# EAGLE design Infrared Temperature Sensor V1.0 (EAGLE 5.11)
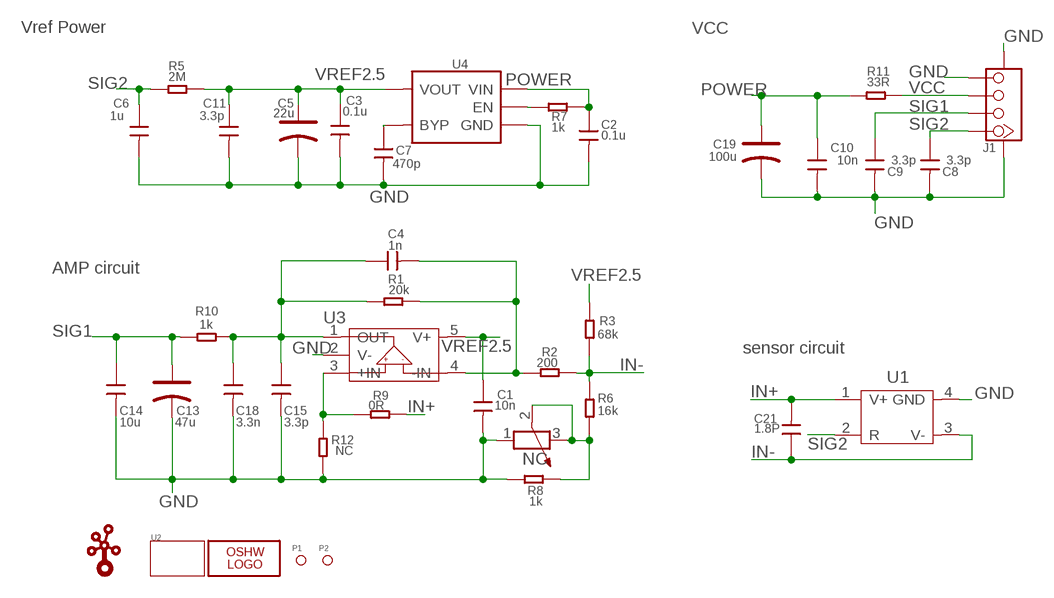
[diagram p0: schematic, sheet 1]

## Parts
C1  10n  C-0603  [0603]
C2  0.1u  C-0402  [0402]
C3  0.1u  C-0402  [0402]
C4  1n  C-0603  [0603]
C5  22u  CAP-AVX-A  [AVX-A]
C6  1u  C-0603  [0603]
C7  470p  C-0402  [0402]
C8  3.3p  C-0402  [0402]
C9  3.3p  C-0402  [0402]
C10  10n  C-0402  [0402]
C11  3.3p  C-0402  [0402]
C13  47u  CAP-AVX-A  [AVX-A]
C14  10u  C-0603  [0603]
C15  3.3p  C-0603  [0603]
C18  3.3n  C-0603  [0603]
C19  100u  CAP-AVX-B  [AVX-B]
C21  1.8P  C-0603  [0603]
J1  TWIG-4P-2.0-SMD-FEMALE-REINFORCE'90D'  [4P-SMD-2.0-90D]
LOGO1  LOGO-OSHW-6MILX0200-NT  [OSHW_6X200_NOTEXT]
P1  PAD-MARK  [ROUND-MARK-0.635]
P2  PAD-MARK  [ROUND-MARK-0.635]
R1  20k  R-0603  [0603]
R2  200  R-0603  [0603]
R3  68k  R-0603  [0603]
R4  NC  R-POTENTIOMETER-SMD  [3P-SMD-SQUA-3.6X3.3]
R5  2M  R-0402  [0402]
R6  16k  R-0603  [0603]
R7  1k  R-0402  [0402]
R8  1k  R-0603  [0603]
R9  0R  R-0603  [0603]
R10  1k  R-0603  [0603]
R11  33R  R-0402  [0402]
R12  NC  R-0603  [0603]
U1  SENSOR-OTP-538U  [4P-5.4MM]
U2  TWIG-2U  [2U-DIM-W/-DRILL]
U3  OPA333  [SOT23-5]
U4  MIC5205  [SOT23-5]
U$1  LOGO-TWIGTWIGLOGO_SMALL  [TWIGLOGO_SMALL]

## Nets
GND: C1.2 C2.2 C3.2 C5.- C6.2 C7.2 C8.2 C9.2 C10.2 C11.2 C13.- C14.2 C15.2 C18.2 C19.- J1.4 J1.SS1 J1.SS2 R4.1 R8.1 R12.1 U1.4(GND) U3.2(V-) U4.2(GND)
IN+: C21.2 R9.1 U1.1(V+)
IN-: C21.1 R2.1 R3.2 R6.1 U1.3(V-)
N$1: C4.2 R1.1 R2.2 U3.4(-IN)
N$2: R4.2 R4.3 R6.2 R8.2
N$3: R7.1 U4.3(EN)
N$4: R9.2 R12.2 U3.3(+IN)
N$5: C7.1 U4.4(BYP)
N$10: C4.1 C15.1 C18.1 R1.2 R10.1 U3.1(OUT)
POWER: C2.1 C10.1 C19.+ R7.2 R11.1 U4.1(VIN)
SIG1: C9.1 C13.+ C14.1 J1.2 R10.2
SIG2: C6.1 C8.1 J1.1 R5.1 U1.2(R)
VCC: J1.3 R11.2
VREF2.5: C1.1 C3.1 C5.+ C11.1 R3.1 R5.2 U3.5(V+) U4.5(VOUT)

## Notes on the sheet
- Vref Power | VCC
- AMP circuit
- sensor circuit

## Library data of the parts
C1-C4 C6-C11 C14 C15 C18 C21 = Discrete:C*: Ceramic Capacitors
C5 C13 C19 = Discrete:CAP*: Electrolytic Capacitors,Tantalum Capacitors and Super Capacitors
J1 = Connector:TWIG-4P-2.0-SMD-FEMALE-REINFORCE
LOGO1 = Logo:LOGO-OSHW-6MIL
P1 P2 = Discrete:PAD-MARK
R1-R3 R5-R12 = Discrete:R*
R4 = Discrete:R-POTENTIOMETER*: Potentiometer
U1 = Discrete:SENSOR-OTP-538U
U2 = Module:TWIG
U3 = IC:OPA333
U4 = IC:MIC5205: The MIC5205 is an efficient linear voltage regulator with ultra-low-noise output, very low dropout voltage (typically 17mV at light loads and 165mV at 150mA), and very low ground current (600µA at 100mA output). The MIC5205 offers better than 1% initial accuracy. datasheet here: http://www.micrel.com/product-info/prod/5205.shtml
U$1 = Logo:LOGO-TWIG

## Board
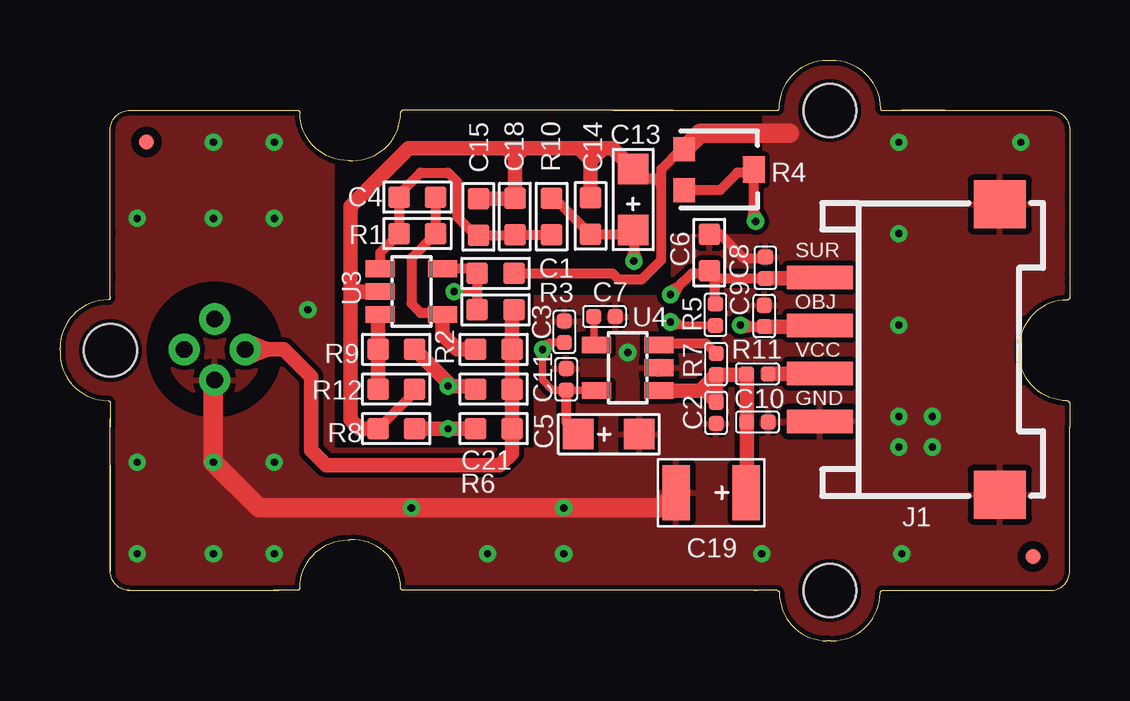
[diagram p1: board, top side]
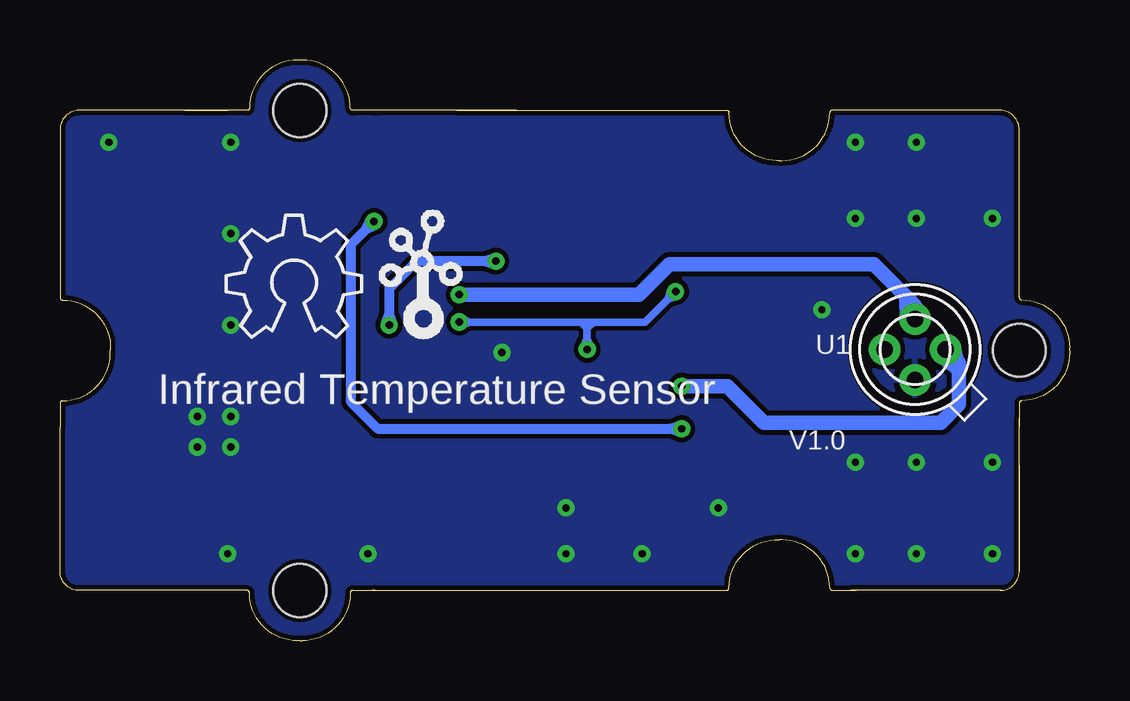
[diagram p2: board, bottom side, seen from below]

Size 42.09 x 24.2 mm. Coordinates in mm from the lower left corner, seen from the top.
Copper layers (1*16): Top 0.035mm / dielectric 1.5mm / Bottom 0.035mm
Design rules "default *": minimum track width 6mil, minimum drill 12mil, track to track 8mil, track to pad 8mil, pad to pad 8mil, via to via 8mil, smd to smd 8mil, copper to edge 8mil, drill to drill 8mil, minimum pad ring 10mil, minimum via ring 8mil, stop-mask expansion 4mil, vias tented up to drill 25mil, thermal gap 10mil
tRestrict: area 11.5,8.1 to 19.7,22; area 19.7,14.4 to 25.4,22; area 25.4,17 to 29.3,22; area 4,9.7 to 8.8,14.6
bRestrict: area 4,9.7 to 8.8,14.6

### Footprints (pad centres in the part's own frame; a part is rotated, then mirrored left to right if it is on the bottom)
0603 = smd 0.889 x 0.889: 1 -0.762,0; 2 0.762,0
0402 = smd 0.635 x 0.635: 1 -0.445,0; 2 0.445,0
AVX-A = smd 1.27 x 1.27: + -1.27,0; - 1.27,0
AVX-B = smd 1.143 x 2.286: + -1.46,0; - 1.46,0
4P-SMD-2.0-90D = smd 0.965 x 2.74: 1 -3,-0.1; 2 -1,-0.1; 3 1,-0.1; 4 3,-0.1 | smd 2 x 2.184: SS1 -6.05,7.4; SS2 6.05,7.4
ROUND-MARK-0.635 = smd 0.635 x 0.635: P$1 0,0
3P-SMD-SQUA-3.6X3.3 = smd 1 x 0.9: 1 -0.85,-1.45; 3 0.85,-1.45 | smd 1.1 x 0.9: 2 0,1.45
4P-5.4MM = drill 0.7 pad 1.3 round: 1 0.9,-0.9; 2 0.9,0.9; 3 -0.9,0.9; 4 -0.9,-0.9
2U-DIM-W/-DRILL = hole 2.2: 10.453,-10.42; 10.453,9.58; -19.535,-0.415
SOT23-5 = smd 0.69 x 1.2: 1 -0.95,-1.3; 2 0,-1.3; 3 0.95,-1.3; 4 0.95,1.3; 5 -0.95,1.3

### Placement (x,y rotation side)
C1  18.16,15.31 0 top
C2  27.35,9.5 270 top
C3  21.03,12.88 90 top
C4  14.9,18.49 0 top
C5  22.88,8.61 0 top
C6  27.07,16.18 90 top
C7  22.7,13.51 0 top
C8  29.41,15.54 90 top
C9  29.36,13.54 90 top
C10  29.08,9.12 0 top
C11  21.1,10.89 90 top
C13  23.9,18.39 90 top
C14  22.12,17.7 90 top
C15  17.44,17.66 90 top
C18  18.97,17.68 90 top
C19  27.15,6.17 180 top
C21  18.08,10.49 180 top
J1  31.78,12.14 270 top
LOGO1  35.17,12.65 0 bottom
P1  3.6,20.77 0 top
P2  40.56,3.5 0 top
R1  14.9,16.96 180 top
R2  18.08,12.14 180 top
R3  18.16,13.79 0 top
R4  27.48,19.63 270 top
R5  27.32,13.59 270 top
R6  18.08,8.84 180 top
R7  27.35,11.53 270 top
R8  14.02,8.84 0 top
R9  14.02,12.14 180 top
R10  20.49,17.68 90 top
R11  29.08,11.12 0 top
R12  14.02,10.49 180 top
U1  6.45,12.14 45 bottom
U2  21.64,12.52 0 top
U3  14.65,14.55 270 top
U4  23.67,11.38 90 top
U$1  29.18,12.44 0 bottom

### Tracks (layer width: path | path; a pad name or v marks a point on that pad's centre or on a via)
GND  (via drill 0.3 pad 0.64)
  Top 0.305: 12.11,15.06 12.62,14.55
  Top 0.406: R12.1 14.78,10.36 R8.1 | C1.2 23.03,15.31 23.29,15.06 24.25,15.06 25.06,15.87 25.06,18.87 | 24.18,19.38 C13.- 24.3,19.25 24.68,19.25 | R4.1 25.89,20.48 25.06,19.66 25.06,19.25 | 25.06,18.87 25.06,19.25 | 25.06,19.25 24.68,19.25 | 25.06,18.87 arc90 24.68,19.25 | C6.2 27.5,16.94 28.49,15.95 29.37,15.95 C8.2
  Top 0.61: 12.36,14.55 12.24,14.55 12.11,14.42 | U3.2 12.62,14.55 12.36,14.55 | 22.27,20.52 23.03,20.52 C13.- | 22.27,20.52 19.35,20.52 | 19.35,20.52 19.1,20.52 | 19.1,20.52 18.59,20.52 | 18.59,20.52 14.52,20.52 12.11,18.11 12.11,15.06 12.11,14.42 | 22.12,20.29 C14.2 | 22.27,20.52 22.12,20.37 22.12,20.29 | 19.1,20.52 18.97,20.39 18.97,20.14 | 18.95,18.42 C15.2 | 12.11,14.42 12.11,14.3 | 12.11,14.3 12.11,9.22 12.49,8.84 R8.1 | 18.97,20.14 18.59,20.52 | 18.97,20.14 C18.2 | 19.35,20.52 18.97,20.14 | 22.27,20.14 22.21,20.08 22.08,20.08 21.7,20.46 | 22.27,20.14 22.59,20.46 | 22.12,20.29 22.27,20.14 | 12.36,14.55 12.11,14.3 | 24.18,19.38 24.18,19.63 24.05,19.76
  Top 0.813: C18.2 18.95,18.42 | C19.- 25.05,5.53 8.3,5.53 v6.4,7.44 6.4,10.82 U1.4 | 30.4,21.16 26.7,21.16 R4.1
  other vias: 23.67,12.01 17.83,3.63 14.65,5.53 29.26,3.63 35.1,3.63 34.97,20.77 34.97,16.96 34.97,9.34 34.97,13.15 40.05,20.77 21,5.53 21,3.63 6.4,20.77 8.94,20.77 8.94,17.6 6.4,17.6 3.22,17.6 3.22,3.63 6.4,3.63 8.94,3.63 8.94,7.44 3.22,7.44 34.97,8.07 36.37,8.07 36.37,9.34 10.33,13.79
  pour Top: -0.59,-0.82 -0.59,24.59 42.59,24.59 42.59,-0.82
  pour Bottom: -0.59,-0.82 -0.59,24.59 42.59,24.59 42.59,-0.82
IN+  (via drill 0.3 pad 0.64)
  Top 0.61: 14.9,12.14 R9.1 16.17,10.74 v16.17,10.62 17.19,10.62 C21.2
  Bottom 0.61: U1.1 4.62,11.58 4.62,11.46 | 4.62,11.25 4.62,9.85 5.38,9.09 12.75,9.09 14.27,10.62 v16.17,10.62 | 4.62,11.25 | 4.62,11.25 4.62,11.46 | 4.62,11.25 5.01,12.21 | U1.1 5.01,12.21 | 4.62,11.25 4.74,11.38 | 4.74,11.38 5.3,12.03 U1.1 | 4.62,11.25 4.74,11.38 | 4.74,11.38 5.3,12.03 U1.1 | 4.62,11.25 5.01,12.21 | 5.01,12.21 U1.1 | 4.62,11.46 5.33,11.83 U1.1 | 4.62,11.46 4.84,12.23 U1.1 | 4.74,11.38 5.38,11.86 | U1.1 5.38,11.86 | 4.74,11.38 4.83,12.18 | 4.74,11.38 5.38,11.86 | U1.1 5.38,11.86 | 4.83,12.18 4.74,11.38 | U1.1 4.83,12.18 | U1.1 5.36,11.85 4.69,11.41 4.83,12.2 U1.1
IN-
  Top 0.61: R3.2 18.84,13.71 R2.1 C21.1 R6.1 18.84,7.82 18.32,7.3 11.1,7.3 10.46,7.94 10.46,11 9.32,12.14 8.77,12.14 | 8.77,12.14 8.59,12.14 | 8.59,12.14 U1.3 | 8.59,12.11 7.75,11.97 | 7.75,11.97 U1.3 | 8.77,12.14 7.75,12.31 | 7.75,12.31 U1.3 | 8.77,12.14 7.75,12.31 | 7.75,12.31 U1.3 | 8.59,12.11 7.75,11.97 | 7.75,11.97 U1.3 | 8.77,12.14 7.75,12.31 | 8.77,12.14 8.59,12.11 | 8.59,12.11 7.75,11.97 | 8.59,12.17 8.77,12.14 | 7.75,12.31 8.59,12.17 | 7.75,12.31 U1.3 | 8.77,12.14 8.59,12.11 | 7.75,11.97 8.59,12.11 | 7.75,11.97 U1.3 | 8.59,12.14 7.86,12.46 U1.3 | 8.59,12.14 7.86,11.82 U1.3 | 7.84,12.46 | 8.59,12.17 7.84,12.46 | U1.3 7.84,12.46 | 8.59,12.17 7.87,11.83 | 7.87,11.83 | U1.3 7.87,11.83 | 8.59,12.11 7.87,12.45 | 8.59,12.11 7.84,11.82 | 7.84,12.46 8.59,12.17 7.87,11.83 | U1.3 7.84,12.46 | U1.3 7.87,11.83 | 7.87,12.45 8.59,12.11 | 7.87,12.45 U1.3 | 7.84,11.82 8.59,12.11 | 7.84,11.82 U1.3
N$1
  Top 0.406: C4.2 R1.1 14.65,15.95 14.65,14.04 15.03,13.66 15.89,13.66 U3.4
  Top 0.61: U3.4 15.95,12.74 16.55,12.14 R2.2
N$2  (via drill 0.3 pad 0.64)
  Top 0.406: 28.93,17.92 R4.2 28.8,19.5 28.24,19.5 27.52,18.78 R4.3 | 28.93,17.92 28.93,17.55 v29,17.47 | 28.93,17.92 28.85,17.5 v29,17.47 | 28.93,17.92 29.14,17.55 v29,17.47
  Top 0.61: R8.2 v16.17,8.84 R6.2
  Bottom 0.406: 16.63,8.84 v16.17,8.84 | 29.32,17.15 v29,17.47 | 29.32,17.15 29.95,16.52 29.95,9.95 28.84,8.84 16.63,8.84 | 16.63,8.84 | 16.63,8.84 16.23,8.98 | 16.63,8.84 16.23,8.69 | 16.23,8.69 | v16.17,8.84 16.23,8.69 | 16.23,8.98 16.63,8.84 | 16.23,8.98 | 16.23,8.98 | 16.63,8.84 16.23,8.98 | 16.23,8.98 v16.17,8.84 | 16.63,8.84 16.23,8.69 | 16.23,8.69 | 16.63,8.84 16.23,8.98 | v16.17,8.84 16.23,8.98 | 16.63,8.84 | 16.23,8.69 16.63,8.84 | 16.23,8.69 v16.17,8.84 | 16.63,8.84 16.23,8.98 | v16.17,8.84 16.23,8.98 | 16.23,8.69 16.63,8.84 | 16.23,8.69 v16.17,8.84 | 29.32,17.15 29.14,17.54 v29,17.47 | 29.32,17.15 28.94,17.34 v29,17.47
N$3
  Top 0.406: U4.3 25.03,12.39 26.93,12.39 R7.1
N$4
  Top 0.61: U3.3 13.25,13.6 R9.2 R12.2
N$5
  Top 0.305: C7.1 22.26,12.44 U4.4
N$10
  Top 0.406: R10.1 C18.1 18.95,16.9 C15.1 17.38,16.84 16.55,17.66 16.55,19.12 16.17,19.5 15.03,19.5 14.14,18.62 C4.1 R1.2 13.35,16.17 U3.1
POWER
  Top 0.61: C10.1 28.62,9.13 | R7.2 28.6,11.08 R11.1 C10.1 | U4.1 | 26.69,10.43 U4.1 | R7.2 26.69,10.43 | 27.35,9.98 C2.1 | R7.2 27.35,9.98 | 26.69,10.43 26.9,10.43 27.35,9.98 | C10.1 28.63,6.19 C19.+
SIG1  (via drill 0.3 pad 0.64)
  Top 0.406: 28.82,13.09 28.43,13.09 v28.37,13.15 | 28.82,13.09 C9.1 | R10.2 20.62,18.44 C14.1 23.72,16.94 C13.+ 23.92,17.09 23.92,16.28 | 23.92,16.28 v23.92,15.82 | 23.92,16.28 | 23.92,16.28 23.78,15.87 | 23.92,16.28 24.07,15.87 | 24.07,15.87 | v23.92,15.82 24.07,15.87 | 23.78,15.87 | 28.82,13.09 28.44,13.29 v28.37,13.15 | 28.82,13.09 28.4,13.01 v28.37,13.15 | 23.78,15.87 23.92,16.28 | 23.78,15.87 | 23.92,16.28 23.78,15.87 | 23.78,15.87 v23.92,15.82 | 23.92,16.28 24.07,15.87 | 24.07,15.87 | 23.92,16.28 23.78,15.87 | v23.92,15.82 23.78,15.87 | 23.92,16.28 | 24.07,15.87 23.92,16.28 | 24.07,15.87 v23.92,15.82 | 23.92,16.28 23.78,15.87 | v23.92,15.82 23.78,15.87 | 24.07,15.87 23.92,16.28 | 24.07,15.87 v23.92,15.82
  Top 0.61: C9.1 31.68,13.09 J1.2
  Bottom 0.406: v23.92,15.82 24.38,15.82 | 28.37,13.61 v28.37,13.15 | 28.37,13.61 28.37,14.68 27.22,15.82 24.38,15.82 | 28.37,13.61 | 28.37,13.61 28.22,13.21 | 28.37,13.61 28.51,13.21 | 28.51,13.21 | v28.37,13.15 28.51,13.21 | 28.22,13.21 | 24.38,15.82 | 24.38,15.82 23.97,15.97 | 23.97,15.97 | v23.92,15.82 23.97,15.97 | 24.38,15.82 23.97,15.68 | 28.22,13.21 28.37,13.61 | 28.22,13.21 | 28.37,13.61 28.22,13.21 | 28.22,13.21 v28.37,13.15 | 28.37,13.61 28.51,13.21 | 28.51,13.21 | 28.37,13.61 28.22,13.21 | v28.37,13.15 28.22,13.21 | 28.37,13.61 | 28.51,13.21 28.37,13.61 | 28.51,13.21 v28.37,13.15 | 28.37,13.61 28.22,13.21 | v28.37,13.15 28.22,13.21 | 28.51,13.21 28.37,13.61 | 28.51,13.21 v28.37,13.15 | 24.38,15.82 | 23.97,15.97 24.38,15.82 | 23.97,15.97 24.38,15.82 | 23.97,15.97 | 23.97,15.68 24.38,15.82 | 23.97,15.68 | v23.92,15.82 23.97,15.68 | 23.97,15.97 24.38,15.82 | v23.92,15.82 23.97,15.97 | 23.97,15.68 24.38,15.82 | 23.97,15.68 | v23.92,15.82 23.97,15.68 | 23.97,15.97 24.38,15.82 | v23.92,15.82 23.97,15.97 | 23.97,15.68 24.38,15.82 | v23.92,15.82 23.97,15.68
SIG2  (via drill 0.3 pad 0.64)
  Top 0.406: v25.45,14.42 25.77,14.75 | 25.77,14.75 26.33,15.31 26.97,15.31 C6.1 | C6.1 27.07,15.34 27.27,15.14 27.27,14.08 R5.1 | C8.1 27.39,15.1 C6.1 | 25.77,14.75 25.38,14.56 v25.45,14.42 | 25.77,14.75 25.58,14.36 v25.45,14.42
  Top 0.61: C8.1 31.68,15.1 J1.1
  Bottom 0.61: v25.45,14.42 17.95,14.42 16.68,15.7 8.17,15.7 6.86,14.38 | 6.86,14.38 6.72,14.24 | 6.72,14.24 6.45,13.97 U1.2 | 6.86,14.38 6.3,13.5 U1.2 | 6.86,14.38 6.82,14.21 | 6.82,14.21 6.61,13.37 U1.2 | 6.72,14.24 6.19,13.64 U1.2 | 6.72,14.24 6.79,13.44 U1.2 | U1.2 6.2,13.65 6.76,14.23 6.79,13.42 U1.2 | 6.82,14.21 6.22,13.67 U1.2 | 6.82,14.21 6.79,13.4 U1.2
VCC
  Top 0.61: R11.2 31.68,11.12 J1.3
VREF2.5  (via drill 0.3 pad 0.64)
  Top 0.305: U4.5 22.34,10.45 C11.1 20.53,10.45 20.11,10.87 20.11,11.68 | v20.11,12.14 20.11,11.68 | 20.46,12.43 20.4,12.43 v20.11,12.14 | 20.46,12.43 C3.1 | 25.88,13.14 25.59,13.14 v25.45,13.28 | 25.88,13.14 R5.2 | 17.39,14.68 17.27,14.55 17.19,14.55 | 17.19,14.55 17.32,14.68 | 16.89,14.55 v16.43,14.55 | 17.19,14.55 16.89,14.55 | 17.19,14.55 17.44,14.3 | 20.11,11.68 | 20.11,11.68 20.29,12.05 | 20.11,11.68 19.93,12.05 | 19.93,12.05 | v20.11,12.14 19.93,12.05 | 20.29,12.05 | 16.89,14.55 | 16.89,14.55 16.52,14.73 | 16.52,14.73 | v16.43,14.55 16.52,14.73 | 16.89,14.55 16.52,14.37 | 25.88,13.14 25.59,13.43 v25.45,13.28 | 25.88,13.14 25.48,13.08 v25.45,13.28 | 20.29,12.05 | 20.11,11.68 | 20.29,12.05 20.11,11.68 | v20.11,12.14 20.29,12.05 | 19.93,12.05 20.11,11.68 | 19.93,12.05 | 20.29,12.05 20.11,11.68 | v20.11,12.14 20.29,12.05 | 20.11,11.68 | 19.93,12.05 20.11,11.68 | v20.11,12.14 19.93,12.05 | 20.29,12.05 20.11,11.68 | v20.11,12.14 20.29,12.05 | 19.93,12.05 20.11,11.68 | v20.11,12.14 19.93,12.05 | 20.46,12.43 20.06,12.34 v20.11,12.14 | 20.46,12.43 20.3,12.06 v20.11,12.14 | 16.89,14.55 16.52,14.73 | 16.89,14.55 | 16.89,14.55 | 16.52,14.73 16.89,14.55 | 16.52,14.73 | 16.89,14.55 16.52,14.37 | 16.52,14.37 | v16.43,14.55 16.52,14.37 | 16.52,14.73 16.89,14.55 | 16.52,14.73 v16.43,14.55 | 16.52,14.37 16.89,14.55 | 16.52,14.37 | 16.52,14.37 v16.43,14.55 | 16.89,14.55 16.52,14.73 | 16.52,14.73 v16.43,14.55 | 16.89,14.55 16.52,14.37 | 16.52,14.37 v16.43,14.55
  Top 0.406: U3.5 17.21,15.5 C1.1 17.39,14.68 R3.1 | C11.1 21.1,9.12 C5.+
  Bottom 0.305: 19.86,13.28 17.7,13.28 16.75,14.23 | 19.86,13.28 20.37,13.28 | 24.99,13.28 v25.45,13.28 | v16.43,14.55 16.75,14.23 | 20.11,12.6 v20.11,12.14 | 20.11,13.03 20.11,12.6 | 20.37,13.28 20.11,13.03 | 19.86,13.28 20.11,13.03 | 20.37,13.28 24.99,13.28 | 24.99,13.28 | 24.99,13.28 25.36,13.1 | 24.99,13.28 25.36,13.46 | 25.36,13.46 | v25.45,13.28 25.36,13.46 | 25.36,13.1 | 20.11,12.6 | 20.11,12.6 19.93,12.23 | 19.93,12.23 | v20.11,12.14 19.93,12.23 | 20.11,12.6 20.29,12.23 | 25.36,13.1 | 24.99,13.28 | 24.99,13.28 25.36,13.1 | v25.45,13.28 25.36,13.1 | 24.99,13.28 25.36,13.46 | 25.36,13.46 | 24.99,13.28 25.36,13.1 | v25.45,13.28 25.36,13.1 | 24.99,13.28 | 24.99,13.28 25.36,13.46 | 25.36,13.46 v25.45,13.28 | 24.99,13.28 25.36,13.1 | v25.45,13.28 25.36,13.1 | 24.99,13.28 25.36,13.46 | 25.36,13.46 v25.45,13.28 | 20.11,12.6 19.93,12.23 | 20.11,12.6 | 20.11,12.6 | 19.93,12.23 20.11,12.6 | 19.93,12.23 | 20.11,12.6 20.29,12.23 | 20.29,12.23 | v20.11,12.14 20.29,12.23 | 19.93,12.23 20.11,12.6 | 19.93,12.23 v20.11,12.14 | 20.29,12.23 20.11,12.6 | 20.29,12.23 | 20.29,12.23 v20.11,12.14 | 20.11,12.6 19.93,12.23 | 19.93,12.23 v20.11,12.14 | 20.11,12.6 20.29,12.23 | 20.29,12.23 v20.11,12.14 | 16.75,14.23 16.62,14.62 v16.43,14.55 | 16.75,14.23 16.36,14.36 v16.43,14.55

### Text on the board
tPlace: SUR | OBJ | VCC | GND
bPlace: Infrared Temperature Sensor | V1.0